# Altium schematic sheet power_amp.SchDoc
size A4; SheetNumber: 1; SheetTotal: 1
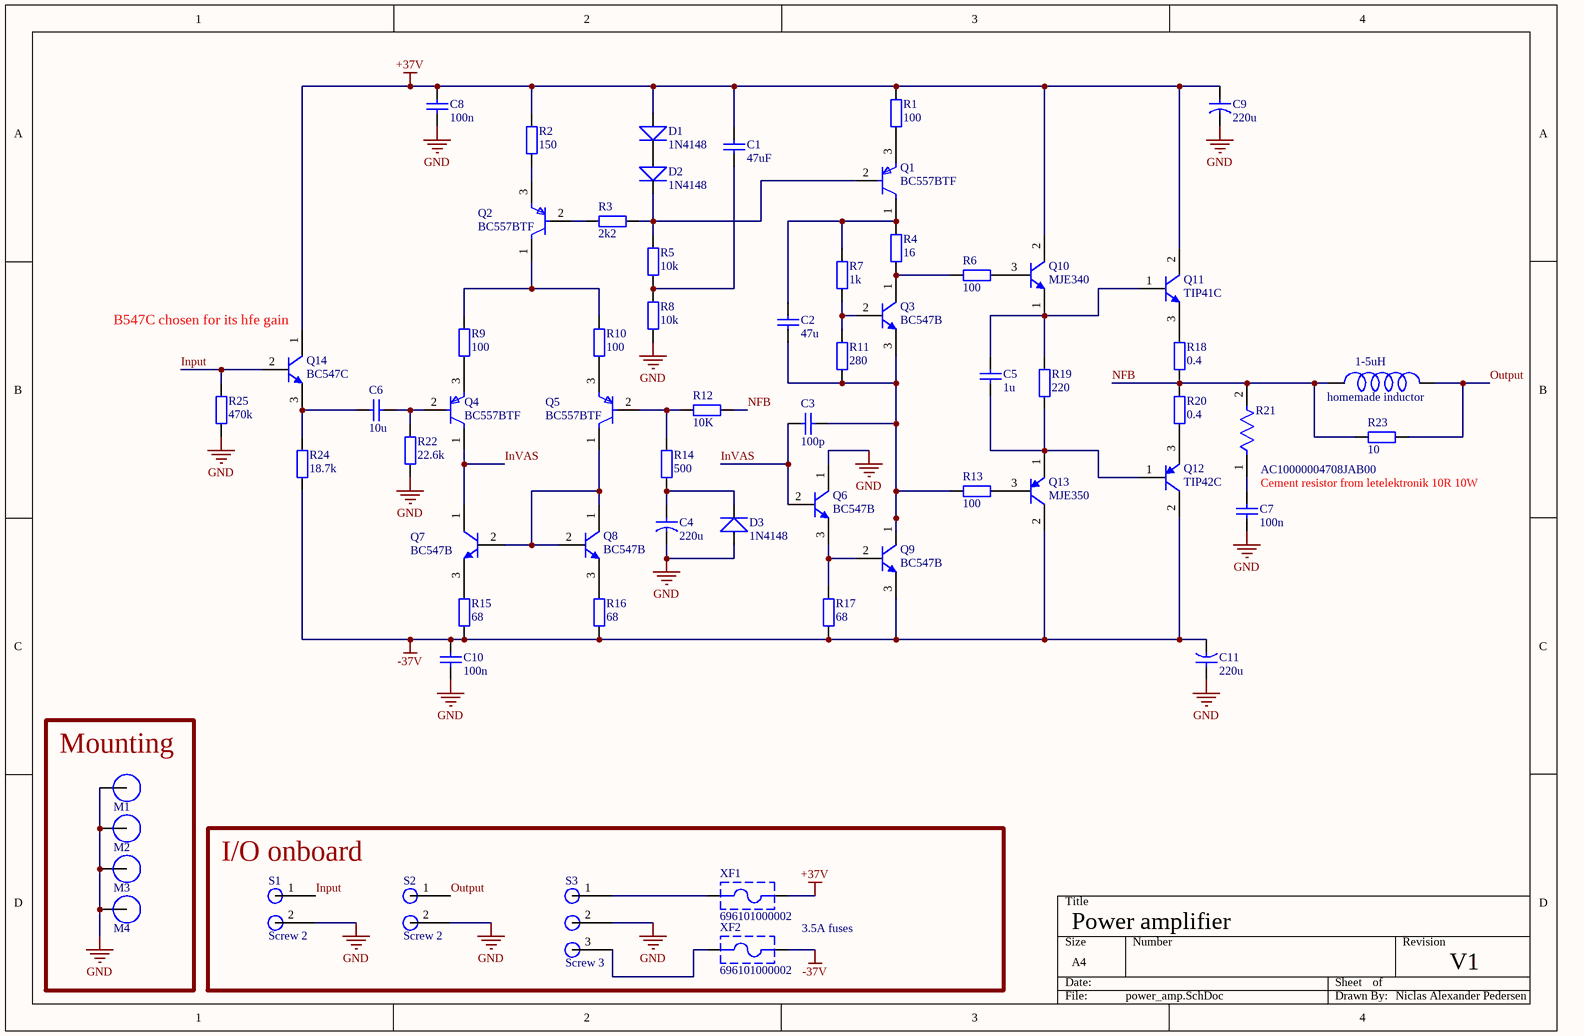
[diagram p0: power_amp.SchDoc]

## Parts
1-5uH  homemade inductor  [homecooked inductor]
C1  value 47uF  [Cap Ø8]  (hidden comment: Cap)
C2  value 47u  [Cap Ø8]  (hidden comment: Cap)
C3  value 100p  [Cap-1]  (hidden comment: Cap)
C4  value 220u  [Cap Lyt Ø8]  (hidden comment: Cap)
C5  value 1u  [Cap Ø8]  (hidden comment: Cap)
C6  value 10u  [Cap Ø8]  (hidden comment: Cap)
C7  value 100n  [Cap Ø8]  (hidden comment: Cap)
C8  value 100n  [Cap-1]  (hidden comment: Cap)
C9  value 220u  [Cap Lyt Ø8]  (hidden comment: Cap)
C10  value 100n  [Cap-1]  (hidden comment: Cap)
C11  value 220u  [Cap Lyt Ø8]  (hidden comment: Cap)
D1  Model: 1N4148  [Diode 2 space]  (hidden comment: Diode DO-35)
D2  Model: 1N4148  [Diode 2 space]  (hidden comment: Diode DO-35)
D3  Model: 1N4148  [Diode 2 space]  (hidden comment: Diode DO-35)
M1  Screw Hole  [M3 Hole]  (value not drawn)  (no BOM)
M2  Screw Hole  [M3 Hole]  (value not drawn)  (no BOM)
M3  Screw Hole  [M3 Hole]  (value not drawn)  (no BOM)
M4  Screw Hole  [M3 Hole]  (value not drawn)  (no BOM)
Q1  BC557BTF  [FP-135AR-MFG]
Q2  BC557BTF  [FP-135AR-MFG]
Q3  BC547B  [ONSC-TO-92-3-29-11]
Q4  BC557BTF  [FP-135AR-MFG]
Q5  BC557BTF  [FP-135AR-MFG]
Q6  BC547B  [ONSC-TO-92-3-29-11]
Q7  BC547B  [ONSC-TO-92-3-29-11]
Q8  BC547B  [ONSC-TO-92-3-29-11]
Q9  BC547B  [ONSC-TO-92-3-29-11]
Q10  MJE340  [ONSC-TO-225-3-77-09]
Q11  TIP41C  [ONSC-TO-220-3-221A-09]
Q12  TIP42C  [ONSC-TO-220-3-221A-09]
Q13  MJE350  [ONSC-TO-225-3-77-09]
Q14  BC547C  [ONSC-TO-92-3-29-11]
R1  value 100  [RES THT 9mm]  (hidden comment: Resistor)
R2  value 150  [RES THT 9mm]  (hidden comment: Resistor)
R3  value 2k2  [RES THT 9mm]  (hidden comment: Resistor)
R4  value 16  [RES THT 9mm]  (hidden comment: Resistor)
R5  value 10k  [RES THT 9mm]  (hidden comment: Resistor)
R6  value 100  [RES THT 9mm]  (hidden comment: Resistor)
R7  value 1k  [RES THT 9mm]  (hidden comment: Resistor)
R8  value 10k  [RES THT 9mm]  (hidden comment: Resistor)
R9  value 100  [RES THT 9mm]  (hidden comment: Resistor)
R10  value 100  [RES THT 9mm]  (hidden comment: Resistor)
R11  value 280  [RES THT 9mm]  (hidden comment: Resistor)
R12  value 10K  [RES THT 9mm]  (hidden comment: Resistor)
R13  value 100  [RES THT 9mm]  (hidden comment: Resistor)
R14  value 500  [RES THT 9mm]  (hidden comment: Resistor)
R15  value 68  [RES THT 9mm]  (hidden comment: Resistor)
R16  value 68  [RES THT 9mm]  (hidden comment: Resistor)
R17  value 68  [RES THT 9mm]  (hidden comment: Resistor)
R18  value 0.4  [RES THT 30mm]  (hidden comment: Resistor)
R19  value 220  [RES THT 9mm]  (hidden comment: Resistor)
R20  value 0.4  [RES THT 30mm]  (hidden comment: Resistor)
R21  AC10000004708JAB00  [FP-AC10-MFG]
R22  value 22.6k  [RES THT 9mm]  (hidden comment: Resistor)
R23  value 10  [RES THT 9mm]  (hidden comment: Resistor)
R24  value 18.7k  [RES THT 9mm]  (hidden comment: Resistor)
R25  value 470k  [RES THT 9mm]  (hidden comment: Resistor)
S1  Screw 2  [Screw-2]
S2  Screw 2  [Screw-2]
S3  Screw 3  [Screw-3]
XF1  696101000002  [696101000002]
XF2  696101000002  [696101000002]

## Blocks framed on the sheet
Mounting: M1-M4
I/O onboard: S1-S3 XF1 XF2

## Nets
+37V: C1.2(g) C8.2(g) C9.1 D1.1 Q10.2(C) Q11.2(C) Q14.1(C) R1.2 R2.2 XF1.2
-37V: C10.2(g) C11.2(g) Q9.3(E) Q12.2(C) Q13.2(C) R15.1 R16.1 R17.1 R24.2 XF2.2
GND: C4.2(g) C7.1 C8.1 C9.2(g) C10.1 C11.1 D3.1 M1.1 M2.1 M3.1 M4.1 Q6.1(C) R8.2 R22.2 R25.1 S1.2 S2.2 S3.2
Input: Q14.2(B) R25.2 S1.1
InVAS: C3.1 Q4.1(C) Q6.2(B) Q7.1(C)
NFB: 1-5uH.1 R12.1 R18.1 R20.2 R21.2 R23.2
Output: 1-5uH.2 R23.1 S2.1
NetC1_1: C1.1 R5.2 R8.1
NetC2_1: C2.1 C3.2(g) Q3.3(E) Q9.1(C) R11.1 R13.2
NetC2_2: C2.2(g) Q1.1(C) R4.2 R7.2
NetC4_1: C4.1 D3.2 R14.1
NetC5_1: C5.1 Q12.1(B) Q13.1(E) R19.1
NetC5_2: C5.2(g) Q10.1(E) Q11.1(B) R19.2
NetC6_1: C6.1 Q4.2(B) R22.1
NetC6_2: C6.2(g) Q14.3(E) R24.1
NetC7_2: C7.2(g) R21.1
NetD1_2: D1.2 D2.1
NetD2_2: D2.2 Q1.2(B) R3.1 R5.1
NetQ1_3: Q1.3(E) R1.1
NetQ2_1: Q2.1(C) R9.2 R10.2
NetQ2_2: Q2.2(B) R3.2
NetQ2_3: Q2.3(E) R2.1
NetQ3_1: Q3.1(C) R4.1 R6.2
NetQ3_2: Q3.2(B) R7.1 R11.2
NetQ4_3: Q4.3(E) R9.1
NetQ5_1: Q5.1(C) Q7.2(B) Q8.1(C) Q8.2(B)
NetQ5_2: Q5.2(B) R12.2 R14.2
NetQ5_3: Q5.3(E) R10.1
NetQ6_3: Q6.3(E) Q9.2(B) R17.2
NetQ7_3: Q7.3(E) R15.2
NetQ8_3: Q8.3(E) R16.2
NetQ10_3: Q10.3(B) R6.1
NetQ11_3: Q11.3(E) R18.2
NetQ12_3: Q12.3(E) R20.1
NetQ13_3: Q13.3(B) R13.1
NetS3_1: S3.1 XF1.1
NetS3_3: S3.3 XF2.1

## Notes on the sheet
- (near Q14) B547C chosen for its hfe gain
- Cement resistor from letelektronik 10R 10W
- 3.5A fuses
- Power amplifier
- V1
- Niclas Alexander Pedersen

## Library data of the parts
C1 C2 C5-C7 = Capacitor unpolarized
C3 C8 C10 = Capacitor 1 space
C4 C9 C11 = Capacitor electrolytic
Q1 Q2 Q4 Q5 = CMP-00278-84408945-1: BC557BTF Small Signal Bipolar Transistor, 0.1A I(C), 45V V(BR)CEO, 1-Element, PNP, Silicon, TO-92; Manufacturer Lifecycle Status: ACTIVE; Max Power Dissipation: 500mW; Frequency: 150MHz; hFE Min: 110; Number of Elements: 1; Current Rating: -100mA; Collector Emitter Saturation Voltage: -250mV; Max Collector Current: 100mA; Emitter Base Voltage (VEBO): -5V; Voltage Rating (DC): -45V; Element Configuration: Single; Max Frequency: 10MHz; Collector Base Voltage (VCBO): -50V; Collector Emitter Voltage (VCEO): 45V; Contact Plating: Tin; Min Operating Temperature: -65°C; RoHS: Compliant; Max Operating Temperature: 150°C; Weight: 240mg; Power Dissipation: 500mW; Lifecycle Status: Production; Case/Package: TO-92; Collector Emitter Breakdown Voltage: 45V; Length: 5.2mm; Schedule B: 8541210080, 8541210080; Lead Free: Lead Free; Polarity: PNP; REACH SVHC: No SVHC; Mount: Through Hole; NexarPartId: 84408945; Max Breakdown Voltage: 45V; Transition Frequency: 150MHz; Height: 5.33mm; Number of Pins: 3; Gain Bandwidth Product: 150MHz; Width: 4.19mm
Q3 Q6-Q9 = CMP-1048-01467-1: Amplifier Transistor, NPN Silicon, 3-Pin TO-92, Bulk Box; Manufacturer: On Semiconductor; IC Continuous (A): 0.1; fT Min (MHz): 150; DatasheetVersion: Rev. 7; ComponentLink1URL: http://www.onsemi.com/; Polarity: NPN; RoHS: FALSE; ComponentLink1Description: Manufacturer URL; Packing: Bulk Box; PackageDescription: 3-Pin Transistor Outline, Body 4.825 x 3.685 mm, Pitch 1.27 mm; ComponentLink3URL: http://www.onsemi.cn/pub_link/Collateral/2N6426-D.PDF; ComponentLink2Description: Datasheet; PackageVersion: Rev. AM; PackageReference: TO-92-3-29-11_AM_SL; ComponentLink3Description: Package Specification; Mounting Technology: Through Hole; PartNumber: BC547B; ComponentLink2URL: http://www.onsemi.com/pub_link/Collateral/BC546-D.PDF
Q10 = CMP-1048-01251-1: Plastic Medium-Power NPN Silicon Transistor, 3-Pin TO-225, Bulk Box; Manufacturer: On Semiconductor; IC Continuous (A): 0.5; Note1: 0; PackageVersion: Rev. AC, 12/2013; PartNumber: MJE340; RoHS: FALSE; ComponentLink2Description: Datasheet; ComponentLink2URL: http://www.onsemi.com/pub_link/Collateral/MJE340-D.PDF; Mounting Technology: Through Hole; Packing: Bulk Box; DatasheetVersion: Rev. 12; PackageReference: TO-225-3-77-09; ComponentLink3URL: http://www.onsemi.com/pub_link/Collateral/77-09.PDF; ComponentLink1URL: http://www.onsemi.com/; Polarity: NPN; ComponentLink3Description: Package Specification; PackageDescription: 3-Pin Flange Mount, Vertical Straight Lead, Body 7.6 x 2.7 mm, Pitch 2.29 mm; ComponentLink1Description: Manufacturer URL
Q11 = CMP-1048-01171-1: Complementary Silicon Plastic Power Transistor, 3-Pin TO-220, Tube; Manufacturer: On Semiconductor; Polarity: NPN; IC Continuous (A): 6; fT Min (MHz): 3; Packing: Tube; PackageVersion: Rev. AG, 09/2011; ComponentLink2URL: http://www.onsemi.com/pub_link/Collateral/TIP41A-D.PDF; ComponentLink1Description: Manufacturer URL; PackageDescription: 3-Pin Flange Mount, Vertical Straight Lead, Body 9.97 x 4.445 mm, Pitch 2.54 mm; ComponentLink3Description: Package Specification; ComponentLink3URL: http://www.onsemi.com/pub_link/Collateral/221A-09.PDF; RoHS: FALSE; PartNumber: TIP41C; DatasheetVersion: Rev. 10; ComponentLink2Description: Datasheet; ComponentLink1URL: http://www.onsemi.com/; Mounting Technology: Through Hole; PackageReference: TO-220-3-221A-09
Q12 = CMP-1048-01107-1: Complementary Silicon Plastic Power Transistor, 3-Pin TO-220, Tube; Manufacturer: On Semiconductor; Polarity: PNP; IC Continuous (A): 6; fT Min (MHz): 3; ComponentLink1URL: http://www.onsemi.com/; ComponentLink3Description: Package Specification; ComponentLink1Description: Manufacturer URL; Packing: Tube; PackageReference: TO-220-3-221A-09; RoHS: FALSE; PackageVersion: Rev. AG, 09/2011; Mounting Technology: Through Hole; ComponentLink2URL: http://www.onsemi.com/pub_link/Collateral/TIP41A-D.PDF; PackageDescription: 3-Pin Flange Mount, Vertical Straight Lead, Body 9.97 x 4.445 mm, Pitch 2.54 mm; ComponentLink2Description: Datasheet; ComponentLink3URL: http://www.onsemi.com/pub_link/Collateral/221A-09.PDF; DatasheetVersion: Rev. 10; PartNumber: TIP42C
Q13 = CMP-1048-01257-1: Plastic Medium-Power PNP Silicon Transistor, 3-Pin TO-225, Bulk Box; Manufacturer: On Semiconductor; IC Continuous (A): 0.5; Note1: 0; RoHS: FALSE; Polarity: PNP; ComponentLink2URL: http://www.onsemi.com/pub_link/Collateral/MJE350-D.PDF; ComponentLink1URL: http://www.onsemi.com/; Mounting Technology: Through Hole; PackageDescription: 3-Pin Flange Mount, Vertical Straight Lead, Body 7.6 x 2.7 mm, Pitch 2.29 mm; ComponentLink1Description: Manufacturer URL; ComponentLink3URL: http://www.onsemi.com/pub_link/Collateral/77-09.PDF; PackageVersion: Rev. AC, 12/2013; ComponentLink3Description: Package Specification; DatasheetVersion: Rev. 16; Packing: Bulk Box; PartNumber: MJE350; ComponentLink2Description: Datasheet; PackageReference: TO-225-3-77-09
Q14 = CMP-1048-01467-1: Amplifier Transistor, NPN Silicon, 3-Pin TO-92, Bulk Box; Manufacturer: On Semiconductor; PartNumber: BC547B; IC Continuous (A): 0.1; fT Min (MHz): 150; DatasheetVersion: Rev. 7; ComponentLink1URL: http://www.onsemi.com/; Polarity: NPN; RoHS: FALSE; ComponentLink1Description: Manufacturer URL; Packing: Bulk Box; PackageDescription: 3-Pin Transistor Outline, Body 4.825 x 3.685 mm, Pitch 1.27 mm; ComponentLink3URL: http://www.onsemi.cn/pub_link/Collateral/2N6426-D.PDF; ComponentLink2Description: Datasheet; PackageVersion: Rev. AM; PackageReference: TO-92-3-29-11_AM_SL; ComponentLink3Description: Package Specification; Mounting Technology: Through Hole; ComponentLink2URL: http://www.onsemi.com/pub_link/Collateral/BC546-D.PDF
R21 = CMP-00030-44829031-1: AC10000004708JAB00 Resistor, 4.7 Ohm, ± 5%, 10 W, Axial Leaded, Wirewound, General Purpose; Temperature Coefficient: -80ppm/°C; Max Power Dissipation: 10W; Resistance: 4.7Ω; Tolerance: 5%; Mount: Through Hole; Radiation Hardening: No; Termination: Axial; Packaging: Tape & Box (TB); Length: 44mm; Diameter: 8mm; Number of Terminations: 2; RoHS: Compliant; Thickness: 8mm; Case/Package: Axial; Min Operating Temperature: -40°C; Width: 8mm; Military Standard: Not; Power Rating: 10W; Composition: Wirewound; Contact Plating: Tin; Features: Flame Retardant Coating; Max Operating Temperature: 200°C; NexarPartId: 44829031
XF1 XF2 = CMP-1502-00233-3: NexarPartId: 56808803; Fuse Current: 10A; Voltage Rating (AC): 250V; RoHS: Non-Compliant; Max Operating Temperature: 120°C; Min Operating Temperature: -30°C; Mount: Through Hole; Packaging: Box; Height: 13.6mm; REACH SVHC: Unknown